# Altium schematic sheet Zoom Camera V1.0.SchDoc
size A3
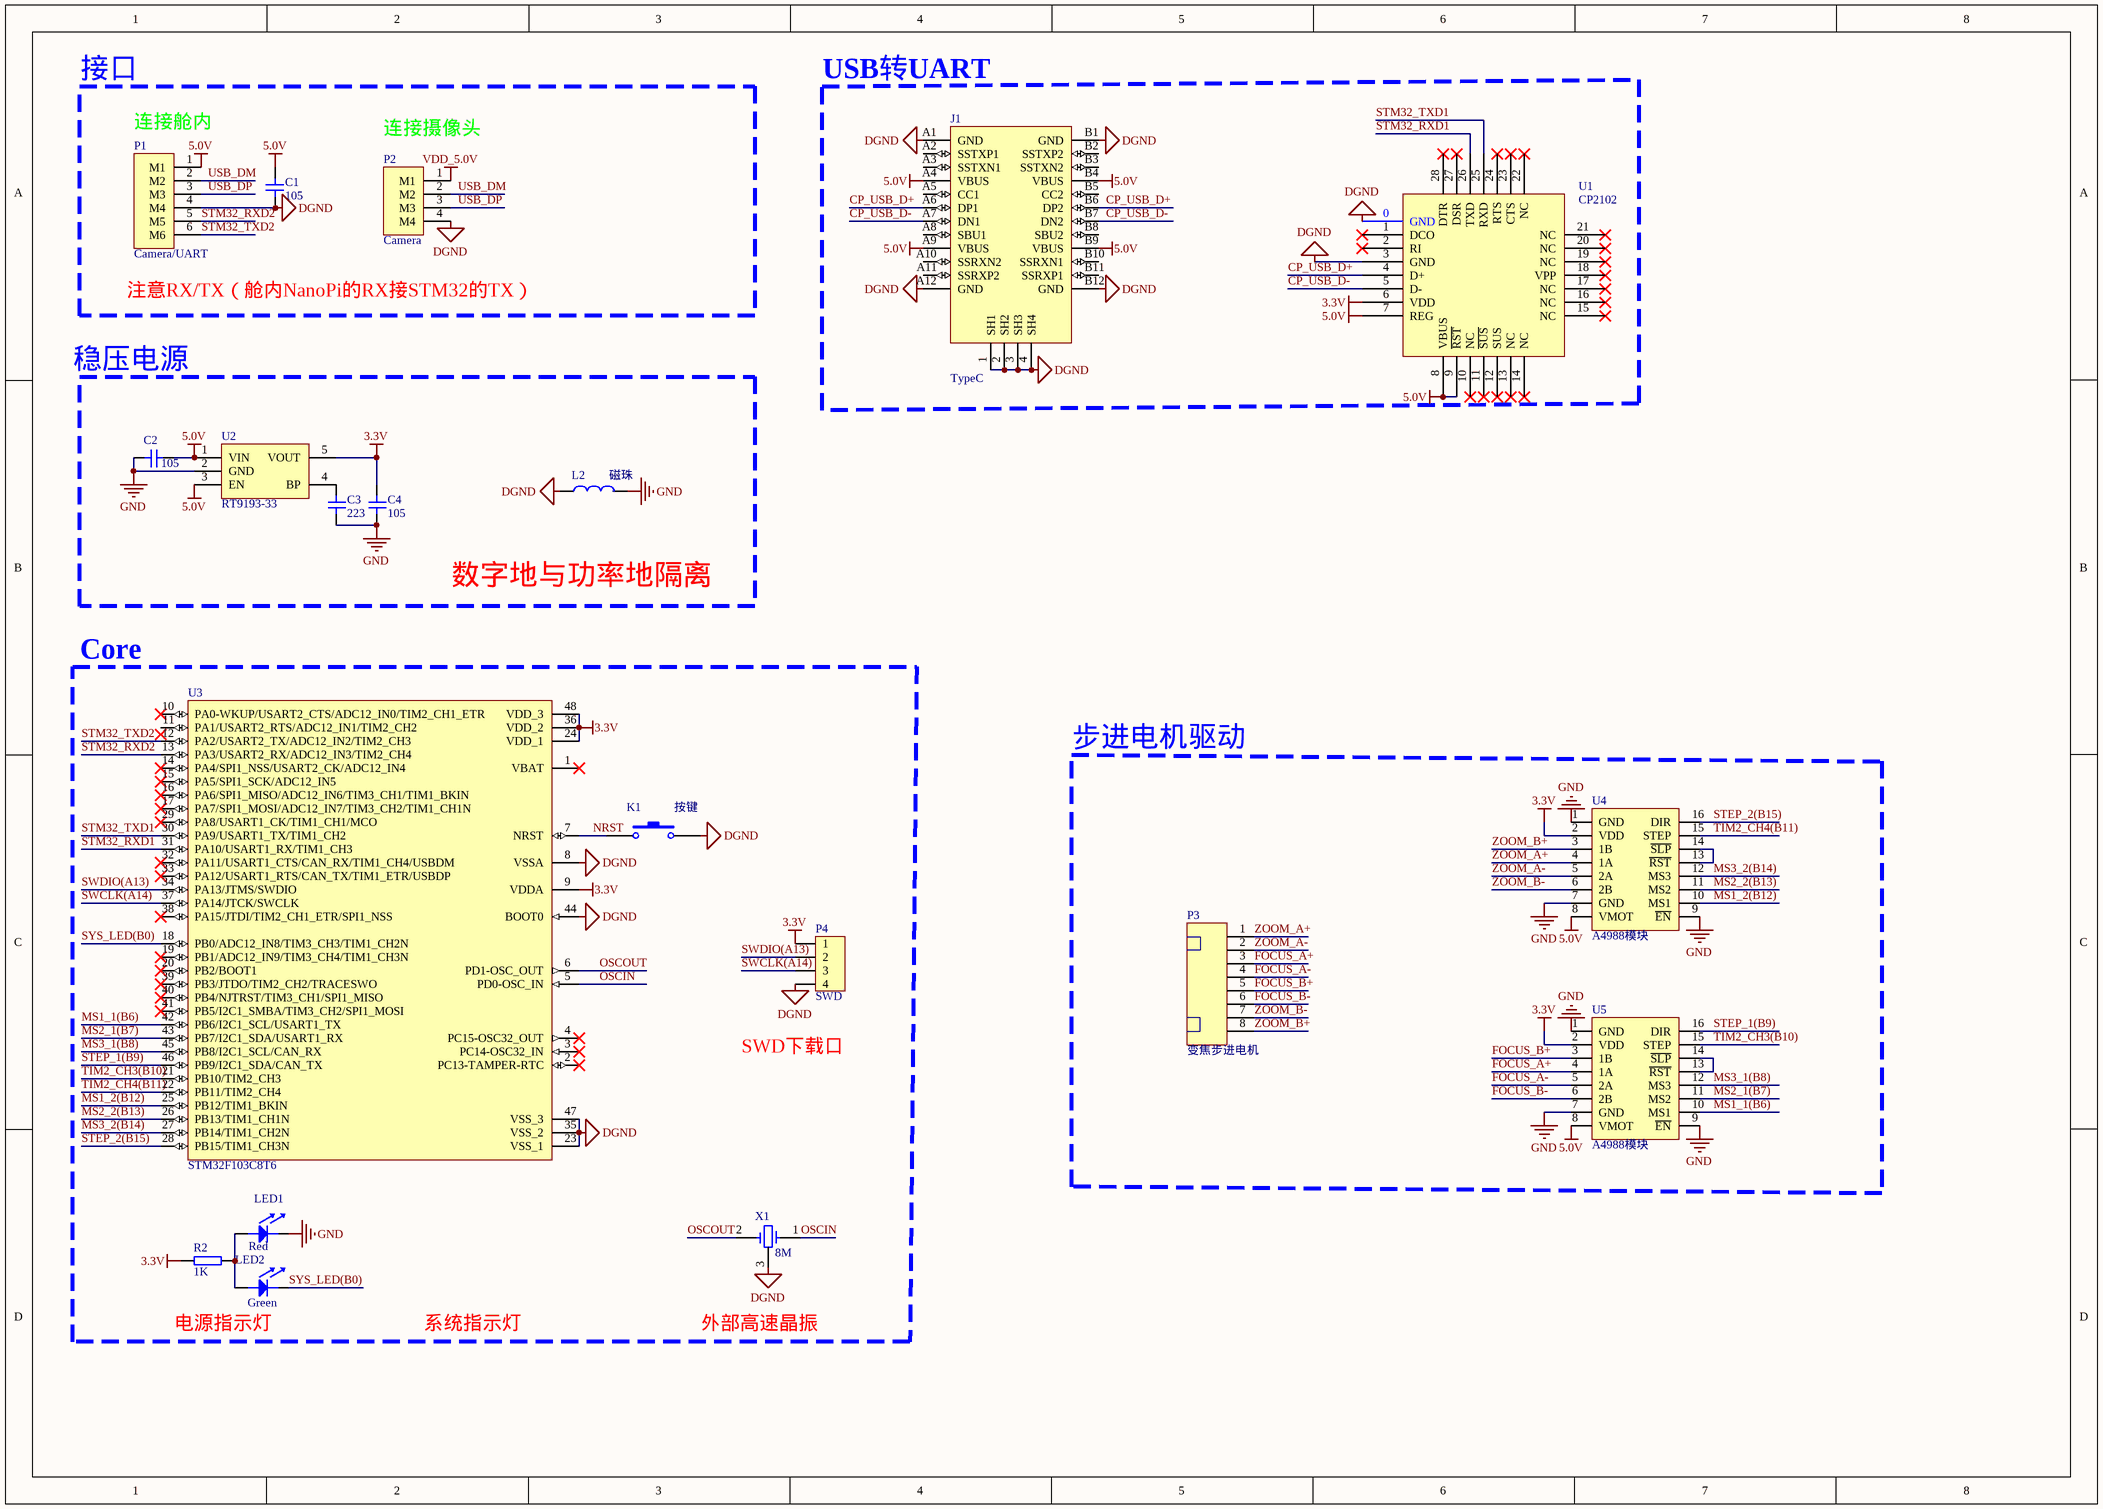
[diagram p0: Zoom Camera V1.0.SchDoc]

## Parts
C1  105  [0805C]
C2  105  [0805C]
C3  223  [0805C]
C4  105  [0805C]
J1  TypeC  [TYPE-C 16P]
K1  按键  [贴片按键]
L2  磁珠  [1206L]
LED1  Red  [0805LED(GREEN)]
LED2  Green  [0805LED(GREEN)]
P1  Camera/UART  [PH2.0WS-6P]
P2  Camera  [PH2.0WS-4P]
P3  变焦步进电机  [MX1.25WS-8P]
P4  SWD  [Header 4]
R2  1K  [0805R]
U1  CP2102  [QFN-28]
U2  RT9193-33  [SOT23-5]
U3  STM32F103C8T6  [LQFP-48]
U4  A4988模块  [A4988 模块(贴片)]
U5  A4988模块  [A4988 模块(贴片)]
X1  8M  [三脚贴片8M晶振]

## Blocks framed on the sheet
接口: C1 P1 P2
数字地与功率地隔离: C2-C4 L2 U2
Core: K1 LED1 LED2 P4 R2 U3 X1
步进电机驱动: P3 U4 U5

## Nets
3.3V: C4.2 P4.1 R2.2 U1.6(VDD) U2.5(VOUT) U3.9(VDDA) U3.24(VDD_1) U3.36(VDD_2) U3.48(VDD_3) U4.2(VDD) U5.2(VDD)
5.0V: C1.1 C2.2 J1.A4(VBUS) J1.A9(VBUS) J1.B4(VBUS) J1.B9(VBUS) P1.1(M1) U1.7(REG) U1.8(VBUS) U1.9(~{RST}) U2.1(VIN) U2.3(EN) U4.8(VMOT) U5.8(VMOT)
DGND: C1.2 J1.1(SH1) J1.2(SH2) J1.3(SH3) J1.4(SH4) J1.A1(GND) J1.A12(GND) J1.B1(GND) J1.B12(GND) K1.2 L2.1 P1.4(M4) P2.4(M4) P4.4 U1.0(GND) U1.3(GND) U3.8(VSSA) U3.23(VSS_1) U3.35(VSS_2) U3.44(BOOT0) U3.47(VSS_3) X1.3
GND: C2.1 C3.1 C4.1 L2.2 LED1.2 U2.2(GND) U4.1(GND) U4.7(GND) U4.9(~{EN}) U5.1(GND) U5.7(GND) U5.9(~{EN})
VDD_5.0V: P2.1(M1)
CP_USB_D+: J1.A6(DP1) J1.B6(DP2) U1.4(D+)
CP_USB_D-: J1.A7(DN1) J1.B7(DN2) U1.5(D-)
FOCUS_A+: P3.3 U5.4(1A)
FOCUS_A-: P3.4 U5.5(2A)
FOCUS_B+: P3.5 U5.3(1B)
FOCUS_B-: P3.6 U5.6(2B)
MS1_1(B6): U3.42(PB6/I2C1_SCL/USART1_TX) U5.10(MS1)
MS1_2(B12): U3.25(PB12/TIM1_BKIN) U4.10(MS1)
MS2_1(B7): U3.43(PB7/I2C1_SDA/USART1_RX) U5.11(MS2)
MS2_2(B13): U3.26(PB13/TIM1_CH1N) U4.11(MS2)
MS3_1(B8): U3.45(PB8/I2C1_SCL/CAN_RX) U5.12(MS3)
MS3_2(B14): U3.27(PB14/TIM1_CH2N) U4.12(MS3)
NRST: K1.1 U3.7(NRST)
OSCIN: U3.5(PD0-OSC_IN) X1.1
OSCOUT: U3.6(PD1-OSC_OUT) X1.2
STEP_1(B9): U3.46(PB9/I2C1_SDA/CAN_TX) U5.16(DIR)
STEP_2(B15): U3.28(PB15/TIM1_CH3N) U4.16(DIR)
STM32_RXD1: U1.26(TXD) U3.31(PA10/USART1_RX/TIM1_CH3)
STM32_RXD2: P1.5(M5) U3.13(PA3/USART2_RX/ADC12_IN3/TIM2_CH4)
STM32_TXD1: U1.25(RXD) U3.30(PA9/USART1_TX/TIM1_CH2)
STM32_TXD2: P1.6(M6) U3.12(PA2/USART2_TX/ADC12_IN2/TIM2_CH3)
SWCLK(A14): P4.3 U3.37(PA14/JTCK/SWCLK)
SWDIO(A13): P4.2 U3.34(PA13/JTMS/SWDIO)
SYS_LED(B0): LED2.2 U3.18(PB0/ADC12_IN8/TIM3_CH3/TIM1_CH2N)
TIM2_CH3(B10): U3.21(PB10/TIM2_CH3) U5.15(STEP)
TIM2_CH4(B11): U3.22(PB11/TIM2_CH4) U4.15(STEP)
USB_DM: P1.2(M2) P2.2(M2)
USB_DP: P1.3(M3) P2.3(M3)
ZOOM_A+: P3.1 U4.4(1A)
ZOOM_A-: P3.2 U4.5(2A)
ZOOM_B+: P3.8 U4.3(1B)
ZOOM_B-: P3.7 U4.6(2B)
NetC3_2: C3.2 U2.4(BP)
NetLED1_1: LED1.1 LED2.1 R2.1
NetU4_13: U4.13(~{RST}) U4.14(~{SLP})
NetU5_13: U5.13(~{RST}) U5.14(~{SLP})

Not connected (* = marked no-connect by the designer): J1 A2(SSTXP1) A3(SSTXN1) A5(CC1) A8(SBU1) A10(SSRXN2) A11(SSRXP2) B2(SSTXP2) B3(SSTXN2) B5(CC2) B8(SBU2) B10(SSRXN1) B11(SSRXP1); U1 1(DCO)* 2(RI)* 10(NC)* 11(~{SUS})* 12(SUS)* 13(NC)* 14(NC)* 15(NC)* 16(NC)* 17(NC)* 18(VPP)* 19(NC)* 20(NC)* 21(NC)* 22(NC)* 23(CTS)* 24(RTS)* 27(DSR)* 28(DTR)*; U3 1(VBAT)* 2(PC13-TAMPER-RTC)* 3(PC14-OSC32_IN)* 4(PC15-OSC32_OUT)* 10(PA0-WKUP/USART2_CTS/ADC12_IN0/TIM2_CH1_ETR)* 11(PA1/USART2_RTS/ADC12_IN1/TIM2_CH2) 14(PA4/SPI1_NSS/USART2_CK/ADC12_IN4)* 15(PA5/SPI1_SCK/ADC12_IN5)* 16(PA6/SPI1_MISO/ADC12_IN6/TIM3_CH1/TIM1_BKIN)* 17(PA7/SPI1_MOSI/ADC12_IN7/TIM3_CH2/TIM1_CH1N)* 19(PB1/ADC12_IN9/TIM3_CH4/TIM1_CH3N)* 20(PB2/BOOT1)* 29(PA8/USART1_CK/TIM1_CH1/MCO)* 32(PA11/USART1_CTS/CAN_RX/TIM1_CH4/USBDM)* 33(PA12/USART1_RTS/CAN_TX/TIM1_ETR/USBDP)* 38(PA15/JTDI/TIM2_CH1_ETR/SPI1_NSS)* 39(PB3/JTDO/TIM2_CH2/TRACESWO)* 40(PB4/NJTRST/TIM3_CH1/SPI1_MISO)* 41(PB5/I2C1_SMBA/TIM3_CH2/SPI1_MOSI)*

## Notes on the sheet
- USB转UART
- (near P1) 连接舱内
- (near P2) 连接摄像头
- 注意RX/TX（舱内NanoPi的RX接STM32的TX）
- 稳压电源
- SWD下载口
- 电源指示灯
- 系统指示灯
- 外部高速晶振

## Library data of the parts
C1-C4 = Cap1: 无极贴片电容
K1 = 贴片按键: 轻触开关
L2 = L: 电感
LED1 LED2 = LED: 发光二极管
P1 = 接线端子-6PIN: 6PIN
P2 = 接线端子-4PIN: 4PIN
P3 = 接线端子-8PIN
P4 = Header 4: 排针
R2 = Res: 电阻
U1 = CP2102: USB转串口芯片
U2 = RT9193
U3 = STM32F103C8T6: STM32单片机48引脚
X1 = XTAL三脚贴片晶振